# EAGLE design Filter_V0.2 (EAGLE 9.5.2)

## Sheet 1 of 3
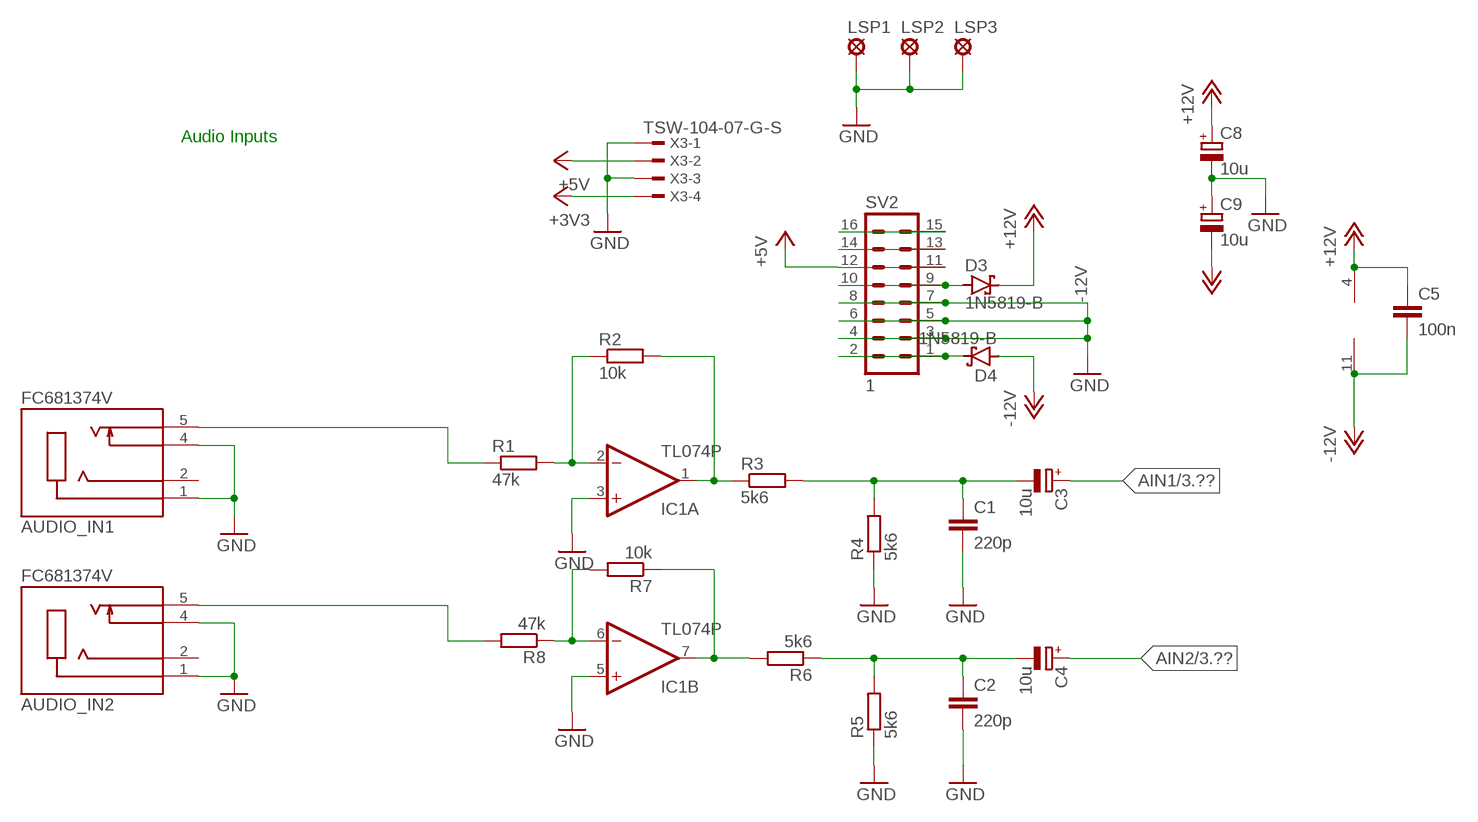
[diagram p0: schematic, sheet 1]

### Parts
AUDIO_IN1  FC681374V  [CLIFF_FC681374V]
AUDIO_IN2  FC681374V  [CLIFF_FC681374V]
C1  220p  C-EU025-024X044  [C025-024X044]
C2  220p  C-EU025-024X044  [C025-024X044]
C3  10u  CPOL-EUE2.5-7  [E2,5-7]
C4  10u  CPOL-EUE2.5-7  [E2,5-7]
C5  100n  C-EU025-024X044  [C025-024X044]
C8  10u  CPOL-EUE2.5-7  [E2,5-7]
C9  10u  CPOL-EUE2.5-7  [E2,5-7]
D3  1N5819-B  [DO41-7.6]
D4  1N5819-B  [DO41-7.6]
IC1  TL074P  [DIL14]
LSP1  LSP10  [LSP10]
LSP2  LSP10  [LSP10]
LSP3  LSP10  [LSP10]
R1  47k  R-EU_0204/7  [0204/7]
R2  10k  R-EU_0204/7  [0204/7]
R3  5k6  R-EU_0204/7  [0204/7]
R4  5k6  R-EU_0204/7  [0204/7]
R5  5k6  R-EU_0204/7  [0204/7]
R6  5k6  R-EU_0204/7  [0204/7]
R7  10k  R-EU_0204/7  [0204/7]
R8  47k  R-EU_0204/7  [0204/7]
SV2  1  ML16  [ML16]
X3  TSW-104-07-G-S  [TSW-104-XX-G-S]

### Nets
+3V3 [Supply]: X3.4 ; also sheet 3
+5V [Supply]: SV2.11 SV2.12 X3.2 ; also sheet 3
+12V [Supply]: C5.1 C8.+ D3.C IC1.4(P:V+)
-12V [Supply]: C5.2 C9.- D4.A IC1.11(P:V-)
AIN1 [Audio]: C3.+ ; also sheet 3
AIN2 [Audio]: C4.+ ; also sheet 3
GND [Supply]: AUDIO_IN1.1 AUDIO_IN1.4 AUDIO_IN2.1 AUDIO_IN2.4 C1.2 C2.2 C8.- C9.+ IC1.3(A:+IN) IC1.5(B:+IN) LSP1.MP LSP2.MP LSP3.MP R4.1 R5.1 SV2.3 SV2.4 SV2.5 SV2.6 SV2.7 SV2.8 X3.1 X3.3 ; also sheet 2,3
N$1: IC1.6(B:-IN) R7.2 R8.1
N$3: IC1.1(A:OUT) R2.2 R3.1
N$4: C1.1 C3.- R3.2 R4.2
N$5: IC1.7(B:OUT) R6.2 R7.1
N$6: C2.1 C4.- R5.2 R6.1
N$8: IC1.2(A:-IN) R1.2 R2.1
N$9: AUDIO_IN1.5 R1.1
N$10: AUDIO_IN2.5 R8.2
N$20 [Supply]: D3.A SV2.9 SV2.10
N$21 [Supply]: D4.C SV2.1 SV2.2
N$25: SV2.13 SV2.14
N$26: SV2.15 SV2.16
Unconnected: AUDIO_IN1.2 AUDIO_IN2.2

### Notes on the sheet
- Audio Inputs

## Sheet 2 of 3
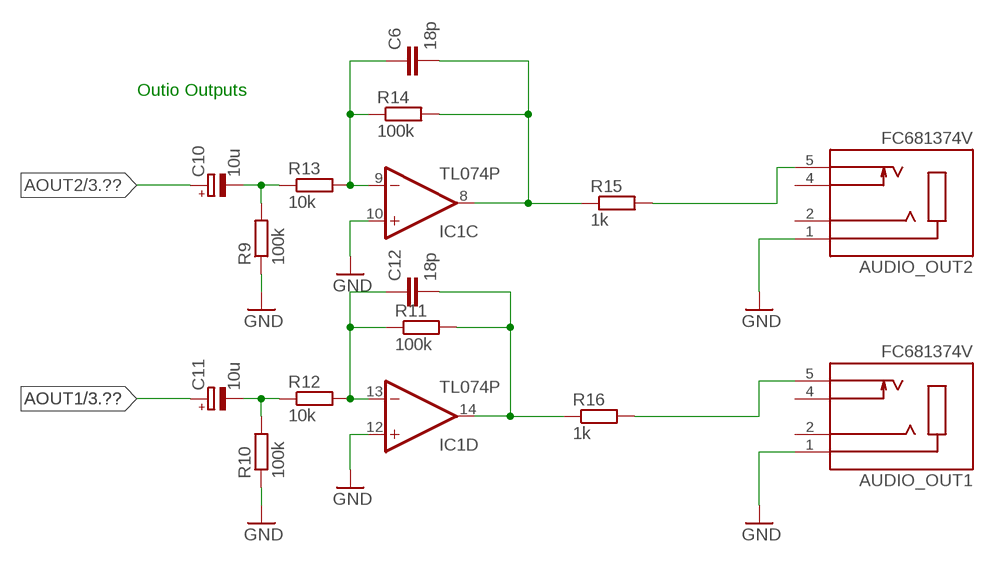
[diagram p1: schematic, sheet 2]

### Parts
AUDIO_OUT1  FC681374V  [CLIFF_FC681374V]
AUDIO_OUT2  FC681374V  [CLIFF_FC681374V]
C6  18p  C-EU025-024X044  [C025-024X044]
C10  10u  CPOL-EUE2.5-7  [E2,5-7]
C11  10u  CPOL-EUE2.5-7  [E2,5-7]
C12  18p  C-EU025-024X044  [C025-024X044]
R9  100k  R-EU_0204/7  [0204/7]
R10  100k  R-EU_0204/7  [0204/7]
R11  100k  R-EU_0204/7  [0204/7]
R12  10k  R-EU_0204/7  [0204/7]
R13  10k  R-EU_0204/7  [0204/7]
R14  100k  R-EU_0204/7  [0204/7]
R15  1k  R-EU_0204/7  [0204/7]
R16  1k  R-EU_0204/7  [0204/7]

### Nets
AOUT1 [Audio]: C11.+ ; also sheet 3
AOUT2 [Audio]: C10.+ ; also sheet 3
GND [Supply]: AUDIO_OUT1.1 AUDIO_OUT2.1 IC1.10(C:+IN) IC1.12(D:+IN) R9.1 R10.1 ; also sheet 1,3
N$11: C6.1 IC1.9(C:-IN) R13.2 R14.1
N$12: C6.2 IC1.8(C:OUT) R14.2 R15.1
N$13: C12.1 IC1.13(D:-IN) R11.1 R12.2
N$14: C12.2 IC1.14(D:OUT) R11.2 R16.1
N$15: AUDIO_OUT1.5 R16.2
N$16: AUDIO_OUT2.5 R15.2
N$17: C10.- R9.2 R13.1
N$18: C11.- R10.2 R12.1
Unconnected: AUDIO_OUT1.2 AUDIO_OUT1.4 AUDIO_OUT2.2 AUDIO_OUT2.4

### Notes on the sheet
- Outio Outputs

## Sheet 3 of 3
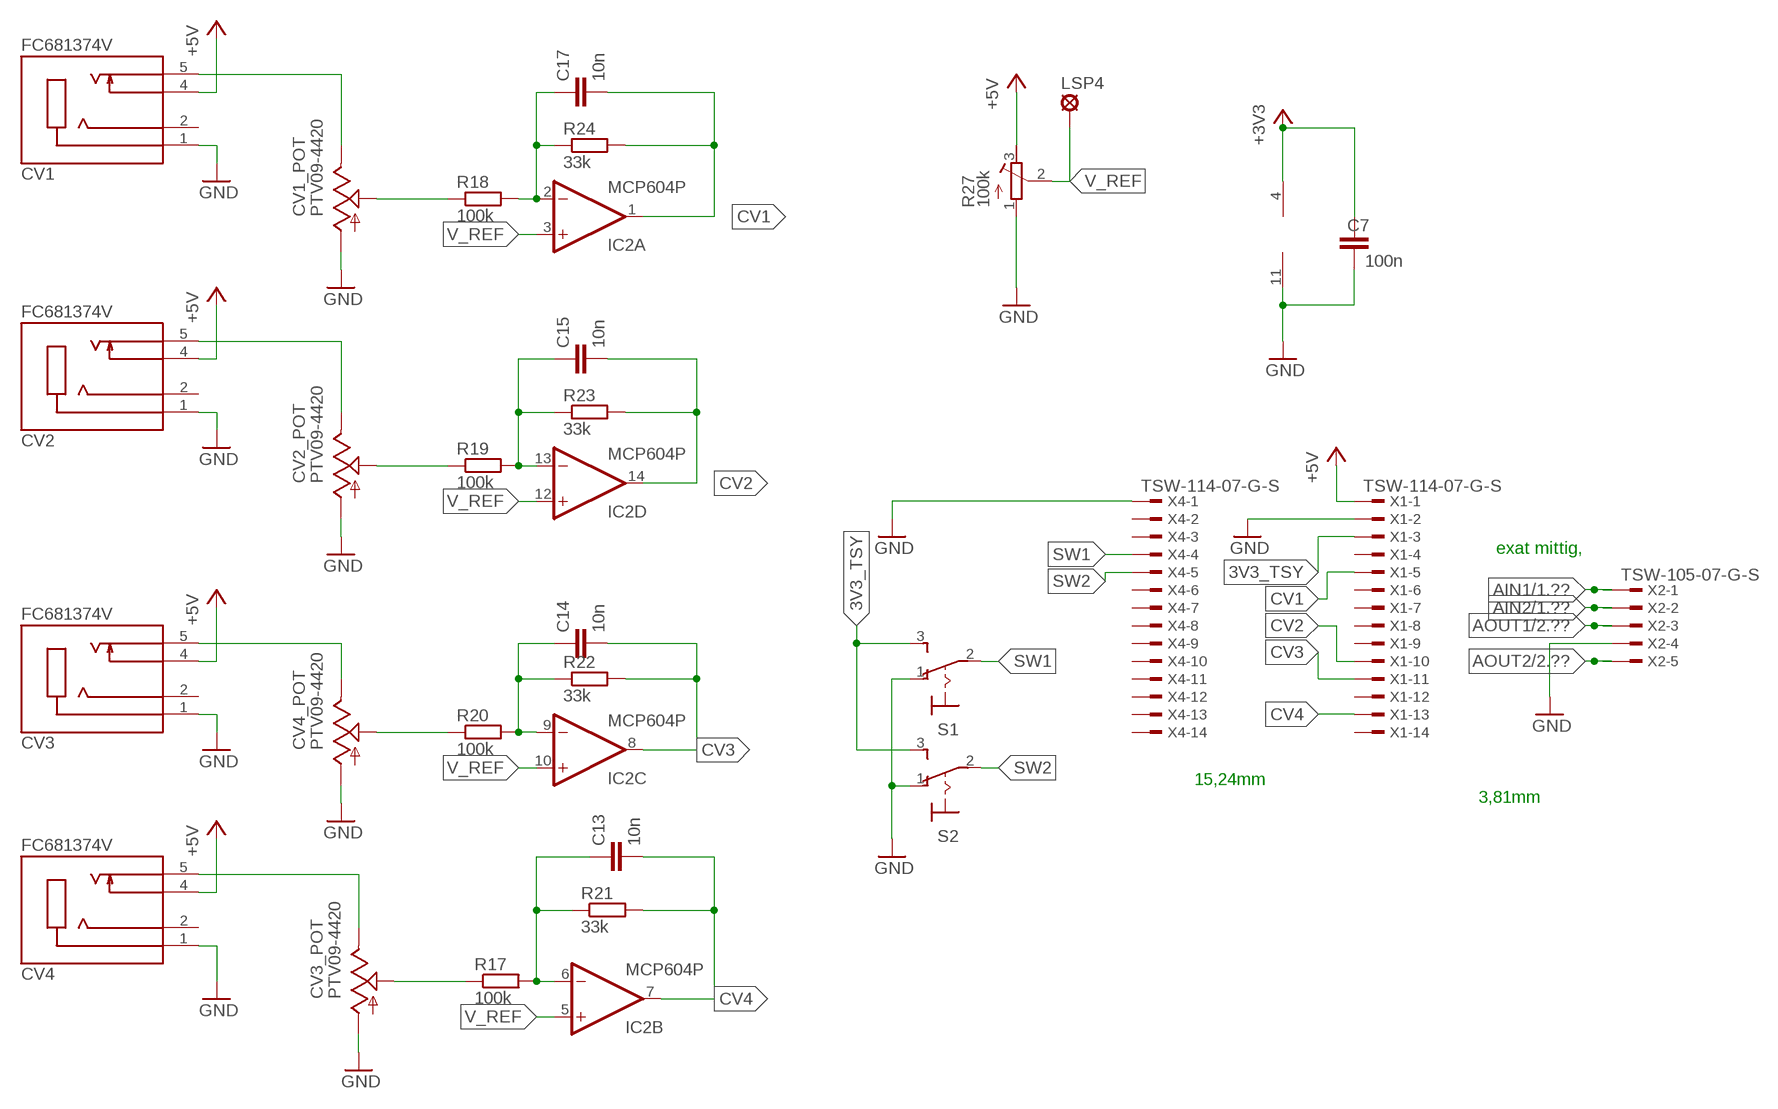
[diagram p2: schematic, sheet 3]

### Parts
C7  100n  C-EU025-024X044  [C025-024X044]
C13  10n  C-EU025-024X044  [C025-024X044]
C14  10n  C-EU025-024X044  [C025-024X044]
C15  10n  C-EU025-024X044  [C025-024X044]
C17  10n  C-EU025-024X044  [C025-024X044]
CV1  FC681374V  [CLIFF_FC681374V]
CV1_POT  PTV09-4420  [PTV09]
CV2  FC681374V  [CLIFF_FC681374V]
CV2_POT  PTV09-4420  [PTV09]
CV3  FC681374V  [CLIFF_FC681374V]
CV3_POT  PTV09-4420  [PTV09]
CV4  FC681374V  [CLIFF_FC681374V]
CV4_POT  PTV09-4420  [PTV09]
IC2  MCP604P  [DIL14]
LSP4  LSP10  [LSP10]
R17  100k  R-EU_0204/7  [0204/7]
R18  100k  R-EU_0204/7  [0204/7]
R19  100k  R-EU_0204/7  [0204/7]
R20  100k  R-EU_0204/7  [0204/7]
R21  33k  R-EU_0204/7  [0204/7]
R22  33k  R-EU_0204/7  [0204/7]
R23  33k  R-EU_0204/7  [0204/7]
R24  33k  R-EU_0204/7  [0204/7]
R27  100k  R-TRIMM64W  [RTRIM64W]
S1  M9040P  [M9040P]
S2  M9040P  [M9040P]
X1  TSW-114-07-G-S  [TSW-114-XX-G-S]
X2  TSW-105-07-G-S  [TSW-105-XX-G-S]
X4  TSW-114-07-G-S  [TSW-114-XX-G-S]

### Nets
3V3_TSY [Supply]: S1.3(S) S2.3(S) X1.3
+3V3 [Supply]: C7.1 IC2.4(P:V+) ; also sheet 1
+5V [Supply]: CV1.4 CV2.4 CV3.4 CV4.4 R27.3(E) X1.1 ; also sheet 1
AIN1 [Audio]: X2.1 ; also sheet 1
AIN2 [Audio]: X2.2 ; also sheet 1
AOUT1 [Audio]: X2.3 ; also sheet 2
AOUT2 [Audio]: X2.5 ; also sheet 2
CV1 [Controll]: C17.2 IC2.1(A:OUT) R24.2 X1.5
CV2 [Controll]: C15.2 IC2.14(D:OUT) R23.2 X1.10
CV3 [Controll]: C14.2 IC2.8(C:OUT) R22.2 X1.11
CV4 [Controll]: C13.2 IC2.7(B:OUT) R21.2 X1.13
GND [Supply]: C7.2 CV1.1 CV1_POT.1(A) CV2.1 CV2_POT.1(A) CV3.1 CV3_POT.1(A) CV4.1 CV4_POT.1(A) IC2.11(P:V-) R27.1(A) S1.1(O) S2.1(O) X1.2 X2.4 X4.1 ; also sheet 1,2
N$19: C13.1 IC2.6(B:-IN) R17.2 R21.1
N$23: C14.1 IC2.9(C:-IN) R20.2 R22.1
N$27: C15.1 IC2.13(D:-IN) R19.2 R23.1
N$29: C17.1 IC2.2(A:-IN) R18.2 R24.1
N$31: CV4_POT.2(S) R20.1
N$32: CV2_POT.2(S) R19.1
N$33: CV1_POT.2(S) R18.1
N$34: CV3_POT.2(S) R17.1
N$35: CV1.5 CV1_POT.3(E)
N$36: CV2.5 CV2_POT.3(E)
N$37: CV3.5 CV4_POT.3(E)
N$38: CV3_POT.3(E) CV4.5
SW1 [Controll]: S1.2(P) X4.4
SW2 [Controll]: S2.2(P) X4.5
V_REF [Supply]: IC2.3(A:+IN) IC2.5(B:+IN) IC2.10(C:+IN) IC2.12(D:+IN) LSP4.MP R27.2(S)
Unconnected: CV1.2 CV2.2 CV3.2 CV4.2 X1.4 X1.6 X1.7 X1.8 X1.9 X1.12 X1.14 X4.2 X4.3 X4.6 X4.7 X4.8 X4.9 X4.10 X4.11 X4.12 X4.13 X4.14

### Notes on the sheet
- exat mittig,
- 15,24mm
- 3,81mm

## Library data of the parts
AUDIO_IN1 AUDIO_IN2 AUDIO_OUT1 AUDIO_OUT2 CV1-CV4 = FC681374V:FC681374V: Flush-mounted stereo jack socket 3.5 mm [Cliff] FC681374V Flush-mounted stereo jack socket 3.5 mm; AVAILABILITY: Unavailable; DESCRIPTION: Flush-mounted stereo jack socket 3.5 mm [Cliff] FC681374V Flush-mounted stereo jack socket 3.5 mm; MF: Cliff; MP: FC681374V; PACKAGE: None; PRICE: None
C1 C2 C5-C7 C12-C15 C17 = rcl:C-EU: CAPACITOR, European symbol; SPICEPREFIX: C
C3 C4 C8-C11 = rcl:CPOL-EU: POLARIZED CAPACITOR, European symbol; SPICEPREFIX: C
CV1_POT CV2_POT CV3_POT CV4_POT = PTV09:PTV09; AVAILABILITY: Unavailable; DESCRIPTION: Instant Conn Red 22-18awg 100/Box; MF: Nichifu; MP: PTV-09; PACKAGE: None; PRICE: None
D3 D4 = diode:1N581*: 1.0A SCHOTTKY BARRIER RECTIFIER Source: http://www.diodes.com/datasheets/ds23001.pdf
IC1 = linear:TL074: OP AMP
IC2 = linear:MCP604: Quad Op Amp 2.7V to 6.0V Single Supply CMOS Source: http://ww1.microchip.com/downloads/en/DeviceDoc/21314g.pdf; SPICEPREFIX: J
LSP1-LSP4 = solpad:LSP10: SOLDER PAD drill 1.0 mm, distributor Buerklin, 12H555
R1-R24 = rcl:R-EU_: RESISTOR, European symbol; SPICEPREFIX: R
R27 = rcl:R-TRIMM: Trimm resistor; SPICEMODEL: X; SPICEPREFIXL: POT
S1 S2 = switch:M9040P: TOGGLE SWITCH Marquardt
SV2 = con-harting-ml:ML16: HARTING; OC_FARNELL: unknown; OC_NEWARK: unknown
X1 X4 = con-samtec:TSW-114-*-G-S: THROUGH-HOLE .025" SQ POST HEADER Source: Samtec TSW.pdf; MF: Samtec Inc.; MPN: TSW-114-07-G-S
X2 = con-samtec:TSW-105-*-G-S: THROUGH-HOLE .025" SQ POST HEADER Source: Samtec TSW.pdf; MF: Samtec Inc.; MPN: TSW-105-07-G-S
X3 = con-samtec:TSW-104-*-G-S: THROUGH-HOLE .025" SQ POST HEADER Source: Samtec TSW.pdf; MF: Samtec Inc.; MPN: TSW-104-07-G-S

## Net classes
0 default: width 0.65 mm, drill 0.65 mm
1 Audio: width 0.65 mm, drill 0.65 mm
2 Supply: width 1 mm, drill 0.65 mm
3 digtal: width 0.65 mm, drill 0.65 mm
4 Controll: width 0.65 mm, drill 0.65 mm

## Board
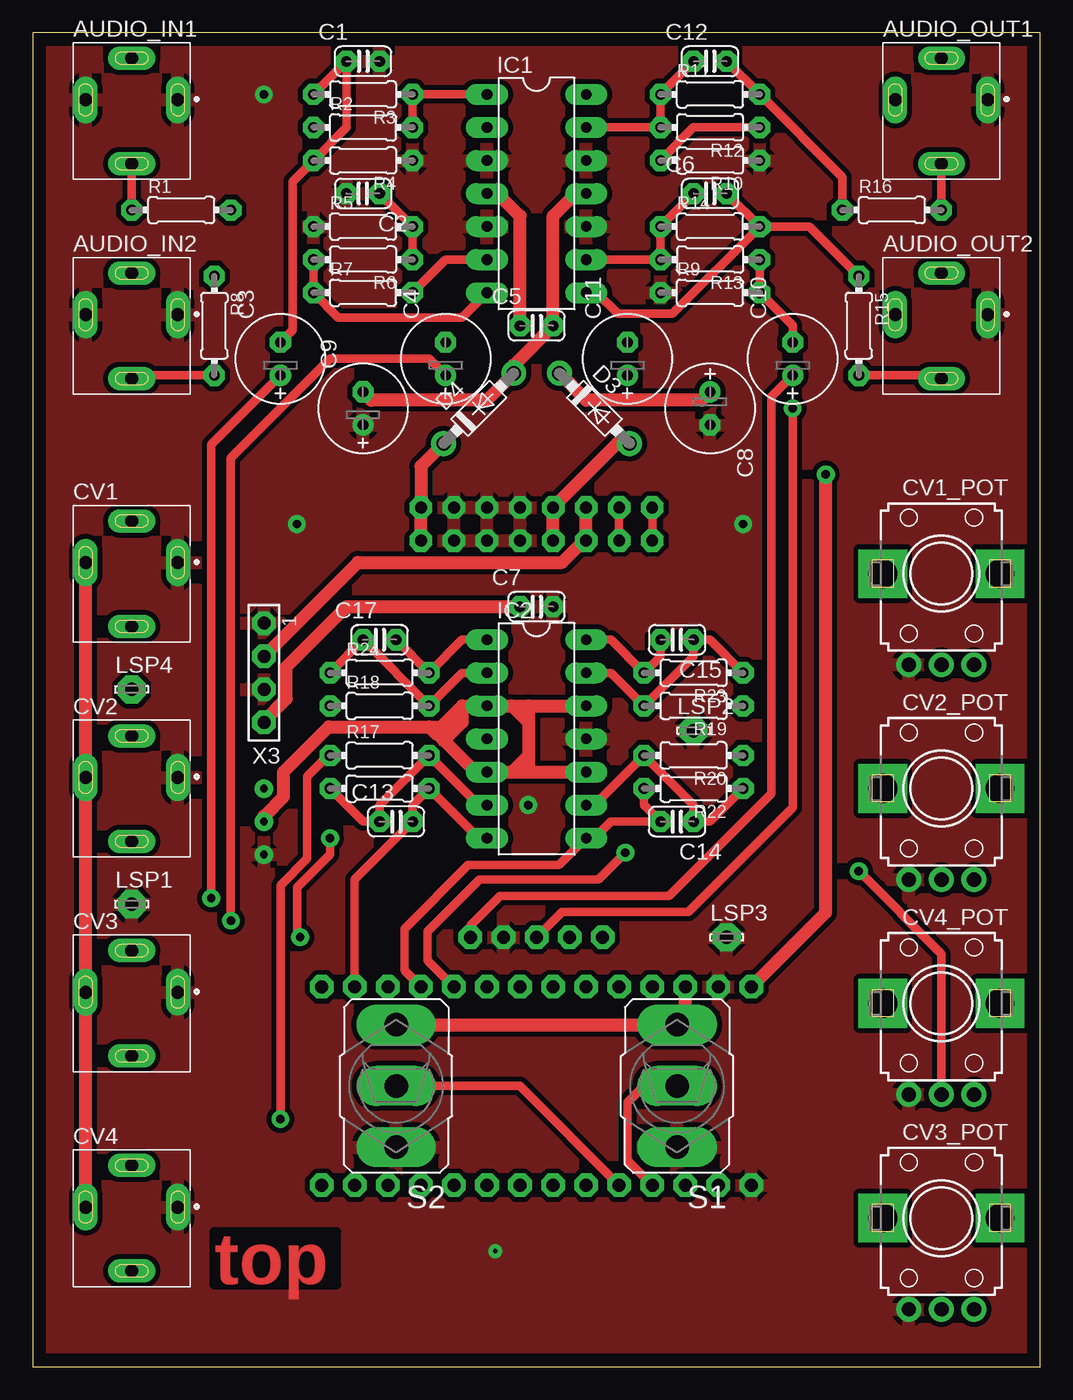
[diagram p3: board, top side]
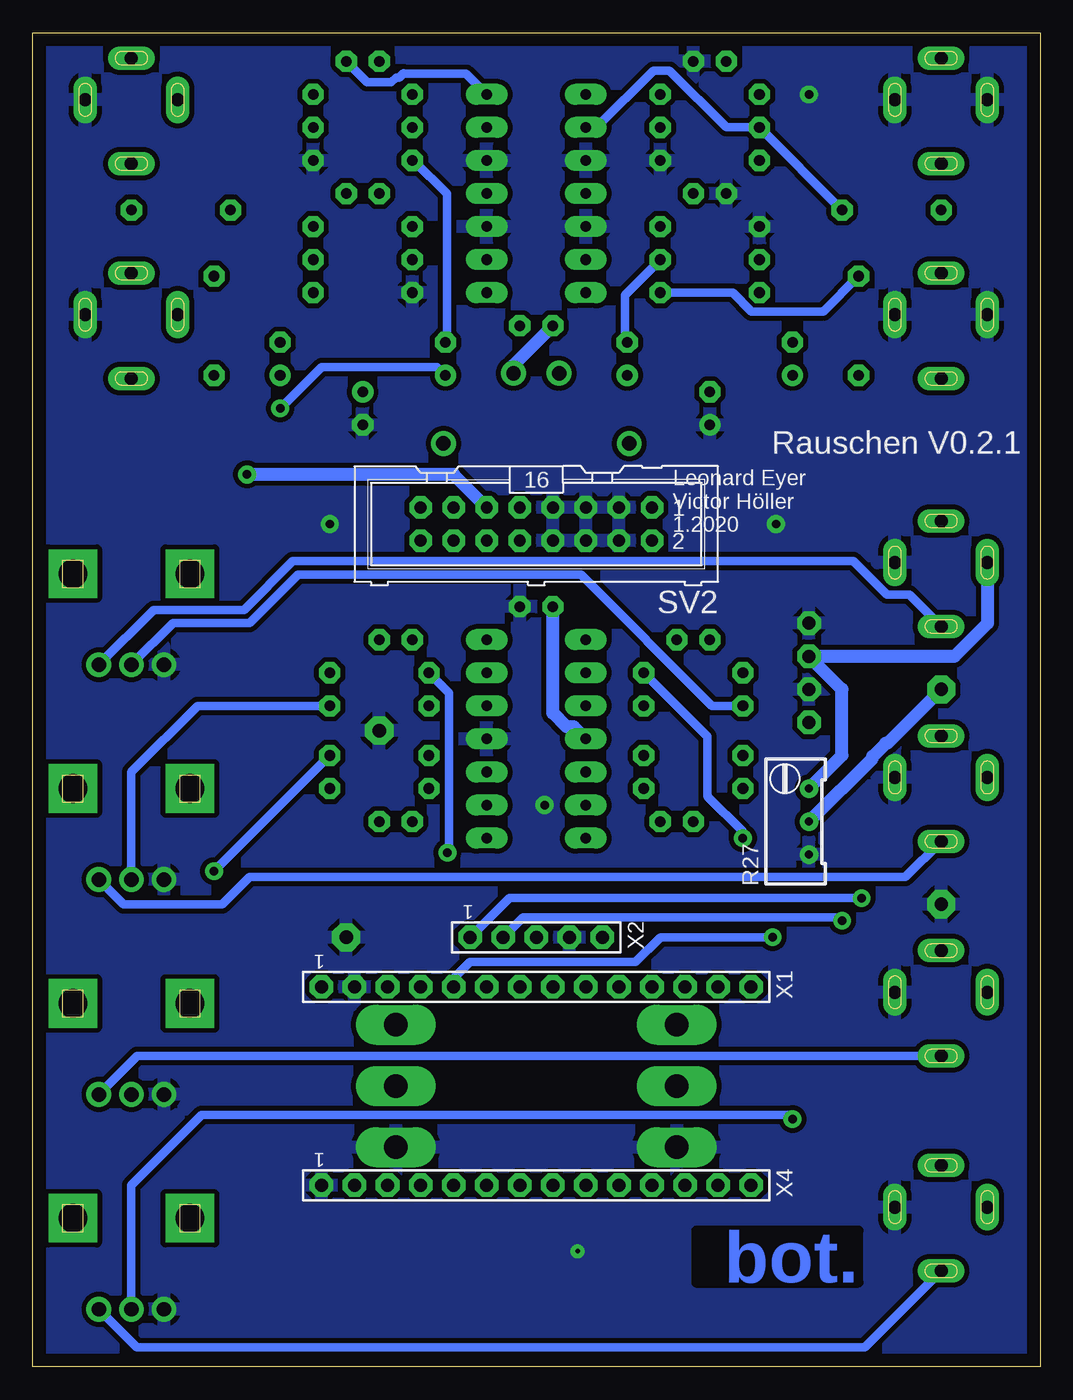
[diagram p4: board, bottom side, seen from below]

Size 77.45 x 102.54 mm. Coordinates in mm from the lower left corner, seen from the top.
Outline: 0,0 77.45,0 77.45,102.54 0,102.54 0,0
Copper layers (1*16): Top 0.035mm / dielectric 1.5mm / Bottom 0.035mm
Design rules "Projektlabor_THT_DRC_2019 *": minimum track width 0.6mm, minimum drill 0.6mm, track to track 15mil, track to pad 12mil, pad to pad 16mil, via to via 20mil, smd to smd 8mil, copper to edge 40mil, drill to drill 16mil, minimum pad ring 16mil, minimum via ring 14mil, stop-mask expansion 4mil, vias tented up to drill 0mil, thermal gap 15mil

### Footprints (pad centres in the part's own frame; a part is rotated, then mirrored left to right if it is on the bottom)
CLIFF_FC681374V = drill 1 long: 1 3.55,0.85; 2 0,4.05; 4 -3.55,0.85; 5 0,-4.05
C025-024X044 = drill 0.813 octagon: 1 -1.27,0; 2 1.27,0
E2,5-7 = drill 0.813 pad 1.6: + -1.27,0 | drill 0.813 pad 1.6 octagon: - 1.27,0
PTV09 = drill 1.1 pad 1.676: 1 -2.5,-7; 2 0,-7; 3 2.5,-7 | drill 2.2 square: M1 4.5,0; M2 -4.5,0
DO41-7.6 = drill 1.1 pad 1.7: A 3.81,0; C -3.81,0
DIL14 = drill 0.813 long: 1 -7.62,-3.81; 2 -5.08,-3.81; 3 -2.54,-3.81; 4 0,-3.81; 5 2.54,-3.81; 6 5.08,-3.81; 7 7.62,-3.81; 8 7.62,3.81; 9 5.08,3.81; 10 2.54,3.81; 11 0,3.81; 12 -2.54,3.81; 13 -5.08,3.81; 14 -7.62,3.81
LSP10 = drill 1.016 pad 2.159 octagon: MP 0,0
0204/7 = drill 0.813 octagon: 1 -3.81,0; 2 3.81,0
RTRIM64W = drill 0.61: 1 1.27,-2.54; 2 1.27,0; 3 1.27,2.54
M9040P = drill 1.803 long: 1 0,4.699; 2 0,0; 3 0,-4.699
ML16 = drill 0.914 octagon: 1 -8.89,-1.27; 2 -8.89,1.27; 3 -6.35,-1.27; 4 -6.35,1.27; 5 -3.81,-1.27; 6 -3.81,1.27; 7 -1.27,-1.27; 8 -1.27,1.27; 9 1.27,-1.27; 10 1.27,1.27; 11 3.81,-1.27; 12 3.81,1.27; 13 6.35,-1.27; 14 6.35,1.27; 15 8.89,-1.27; 16 8.89,1.27
TSW-114-XX-G-S = drill 1 pad 1.5 octagon: 1 16.51,0; 2 13.97,0; 3 11.43,0; 4 8.89,0; 5 6.35,0; 6 3.81,0; 7 1.27,0; 8 -1.27,0; 9 -3.81,0; 10 -6.35,0; 11 -8.89,0; 12 -11.43,0; 13 -13.97,0; 14 -16.51,0
TSW-105-XX-G-S = drill 1 pad 1.5 octagon: 1 5.08,0; 2 2.54,0; 3 0,0; 4 -2.54,0; 5 -5.08,0
TSW-104-XX-G-S = drill 1 pad 1.5 octagon: 1 3.81,0; 2 1.27,0; 3 -1.27,0; 4 -3.81,0

### Placement (x,y rotation side)
AUDIO_IN1  7.62,96.52 0 top
AUDIO_IN2  7.62,80.01 0 top
AUDIO_OUT1  69.85,96.52 0 top
AUDIO_OUT2  69.85,80.01 0 top
C1  25.4,100.33 0 top
C2  25.4,90.17 180 top
C3  19.05,77.47 90 top
C4  31.75,77.47 90 top
C5  38.73,80.01 0 top
C6  52.07,90.17 0 top
C7  38.73,58.42 0 top
C8  52.07,73.66 270 top
C9  25.4,73.66 90 top
C10  58.42,77.47 90 top
C11  45.72,77.47 90 top
C12  52.07,100.33 0 top
C13  27.94,41.91 0 top
C14  49.53,41.91 180 top
C15  49.53,55.88 180 top
C17  26.67,55.88 0 top
CV1  7.62,60.96 0 top
CV1_POT  69.85,60.96 0 top
CV2  7.62,44.45 0 top
CV2_POT  69.85,44.45 0 top
CV3  7.62,27.94 0 top
CV3_POT  69.85,11.43 0 top
CV4  7.62,11.43 0 top
CV4_POT  69.85,27.94 0 top
D3  43.18,73.66 315 top
D4  34.29,73.66 45 top
IC1  38.73,90.17 270 top
IC2  38.73,48.26 270 top
LSP1  7.62,35.56 0 top
LSP2  50.8,48.9 0 top
LSP3  53.34,33.02 0 top
LSP4  7.62,52.07 0 top
R1  11.43,88.9 0 top
R2  25.4,95.25 0 top
R3  25.4,97.79 180 top
R4  25.4,92.71 180 top
R5  25.4,87.63 0 top
R6  25.4,85.09 180 top
R7  25.4,82.55 0 top
R8  13.97,80.01 270 top
R9  52.07,82.55 0 top
R10  52.07,92.71 180 top
R11  52.07,97.79 0 top
R12  52.07,95.25 180 top
R13  52.07,85.09 180 top
R14  52.07,87.63 0 top
R15  63.5,80.01 270 top
R16  66.04,88.9 0 top
R17  26.67,46.99 0 top
R18  26.67,50.8 0 top
R19  50.8,50.8 180 top
R20  50.8,46.99 180 top
R21  26.67,44.45 0 top
R22  50.8,44.45 180 top
R23  50.8,53.34 180 top
R24  26.67,53.34 0 top
R27  19.05,41.91 0 bottom
S1  49.53,21.59 180 top
S2  27.94,21.59 180 top
SV2  38.73,64.77 180 bottom
X1  38.73,29.21 180 bottom
X2  38.73,33.02 180 bottom
X3  17.78,53.34 90 top
X4  38.73,13.97 180 bottom

### Tracks (layer width: path | path; a pad name or v marks a point on that pad's centre or on a via)
3V3_TSY
  Top 1: S2.3 S1.3 50.16,26.92 X1.3
+3V3
  Top 1: X3.4 17.78,49.65 19.49,51.36 19.49,53.78 24.13,58.42 C7.1
  Bottom 1: IC2.4 35.85,49.18 36.41,49.18 37.47,50.24 C7.1
+5V  (via drill 0.65)
  Top 1: CV1.4 CV2.4 CV3.4 CV4.4 | SV2.11 SV2.12 42.36,63.5 40.7,61.83 25,61.83 X3.2 | X1.1 60.96,34.92 v60.96,68.58
  Bottom 1: SV2.11 45.09,68.58 v60.96,68.58 | CV1.4 4.07,57.13 6.59,54.61 X3.2 15.24,52.07 15.24,46.99 R27.3
+12V
  Top 1: IC1.4 35.74,90.17 37.47,88.44 C5.1 | C8.+ 51.44,74.3 42.55,74.3 D3.C
  Bottom 1: D3.C 40.49,76.99 C5.1
-12V
  Top 1: IC1.11 41.73,90.17 40.01,88.44 C5.2 36.98,76.99 D4.A 34.92,74.3 26.04,74.3 C9.-
AIN1  (via drill 0.65)
  Top 0.65: C3.+ 13.73,70.88 v13.73,36.03
  Bottom 0.65: v13.73,36.03 40.8,36.03 X2.1
AIN2  (via drill 0.65)
  Top 0.65: v15.24,34.29 15.24,69.85 22.86,77.47 30.48,77.47 C4.+
  Bottom 0.65: v15.24,34.29 15.51,34.56 39.74,34.56 X2.2
AOUT1  (via drill 0.65)
  Top 0.65: v58.42,73.66 58.42,69.86 58.42,69.85 58.42,43 50.4,34.98 40.69,34.98 X2.3
  Bottom 0.65: C11.+ 46.35,76.83 55.24,76.83 v58.42,73.66
AOUT2
  Top 0.65: C10.+ 56.77,74.55 56.77,44.07 48.9,36.2 35.93,36.2 33.66,33.92 X2.5
CV1  (via drill 0.65)
  Top 0.65: C17.2 R24.2 33.02,55.88 IC2.1 | v22.86,40.64 22.86,39.37 20.32,36.83 20.32,33.02 v20.56,33.02
  Bottom 0.65: R24.2 25.57,48.43 25.57,43.85 22.86,41.14 v22.86,40.64 | X1.5 45.09,29.84 43.81,31.11 31.11,31.11 29.21,33.02 v20.56,33.02
CV2  (via drill 0.65)
  Top 0.65: C15.2 48.26,54.61 R23.2 44.45,55.88 IC2.14 | v45.56,39.52 43.51,37.47 34.34,37.47 30.35,33.47 30.35,31.25 X1.10
  Bottom 0.65: v45.56,39.52 45.44,39.66 45.44,51.78 R23.2
CV3
  Top 0.65: R22.2 46.99,43.18 C14.2 44.45,41.91 43.18,40.64 IC2.8 40.46,38.56 33.48,38.56 28.57,33.66 28.57,30.48 X1.11
CV4
  Top 0.65: IC2.7 34.29,40.64 R21.2 29.21,43.18 C13.2 24.77,37.47 X1.13
GND  (via drill 0.35, 0.65)
  other vias: 35.56,8.89 54.61,64.77 20.32,64.77 17.78,97.79 38.1,43.18
  pour Top: -1.27,104.14 78.74,104.14 78.74,-1.27 -1.27,-1.27
  pour Bottom: 0,104.14 78.74,104.14 78.74,-1.27 0,-1.27
N$1
  Top 0.65: IC1.6 31.75,85.09 R7.2
  Bottom 0.65: R7.2 23.63,82.55 22.19,81.11 16.68,81.11 R8.1
N$3
  Top 0.65: IC1.1 R3.1 R2.2
N$4
  Top 0.65: R3.2 C1.1 24.13,95.25 R4.2 19.97,91.09 19.97,79.66 C3.-
N$5
  Top 0.65: R6.2 R7.1 23.5,80.64 33.02,80.64 IC1.7
N$6
  Top 0.65: R6.1 R5.2 C2.1
  Bottom 0.65: C4.- 31.92,78.91 31.92,82.38 R6.1
N$8
  Bottom 0.65: IC1.2 34.11,95.25 29.75,99.61 28.49,99.61 24.13,95.25 R2.1 R1.2
N$9
  Top 0.65: R1.1 AUDIO_IN1.5
N$10
  Top 0.65: AUDIO_IN2.5 7.86,76.2 R8.2
N$11
  Top 0.65: C6.1 R14.1 R13.2 IC1.9
N$12
  Top 0.65: IC1.8 43.36,82.55 44.98,80.93 49.18,80.93 R14.2 | C6.2 R14.2 | R14.2 59.69,87.63 R15.1
N$13
  Top 0.65: C12.1 R11.1 R12.2 IC1.13
N$14
  Top 0.65: C12.2 R11.2 62.23,91.44 R16.1
  Bottom 0.65: C12.2 51.72,98.71 49.88,98.71 49.53,99.06 49.28,99.06 48.93,99.41 48.9,99.38 44.13,99.38 IC1.14
N$15
  Top 0.65: AUDIO_OUT1.5 R16.2
N$16
  Top 0.65: R15.2 69.61,76.2 AUDIO_OUT2.5
N$17
  Top 0.65: C10.- 58.42,80.01 R9.2 R13.1
N$18
  Top 0.65: R10.2 50.8,95.25 R12.1
  Bottom 0.65: C11.- 45.61,78.85 45.61,90.17 48.15,92.71 R10.2
N$19
  Top 0.65: IC2.6 34.29,43.18 R17.2 26.67,43.18 C13.1 25.4,41.91 R21.1
N$20
  Top 1: SV2.10 SV2.9 44.93,70.97 D3.A
N$21
  Top 1: SV2.2 SV2.1 29.84,69.22 D4.C
N$23
  Top 0.65: IC2.9 43.18,43.18 R20.2 50.8,43.18 C14.1 52.07,41.91 R22.1
N$25
  Top 0.65: SV2.14 SV2.13
N$26
  Top 0.65: SV2.16 SV2.15
N$27
  Top 0.65: R23.1 52.07,55.88 C15.1 50.8,54.61 R19.2 44.45,53.34 IC2.13
N$29
  Top 0.65: R24.1 C17.1 R18.2 33.02,53.34 IC2.2
N$31  (via drill 0.65)
  Top 0.65: v63.5,38.1 69.85,31.75 CV4_POT.2
  Bottom 0.65: v63.5,38.1 R20.1
N$32
  Bottom 0.65: R19.1 64.77,50.8 69.85,45.72 CV2_POT.2
N$33
  Bottom 0.65: R18.1 25.23,50.8 35.31,60.88 57.04,60.88 60.77,57.15 66.66,57.15 CV1_POT.2
N$34  (via drill 0.65)
  Top 0.65: R17.1 22.73,46.99 21.1,45.37 21.1,39.07 19.05,37.02 v19.05,19.05
  Bottom 0.65: v19.05,19.05 19.37,19.37 64.45,19.37 69.85,13.97 CV3_POT.2
N$35
  Bottom 0.65: CV1_POT.3 68.13,58.18 61.2,58.18 57.47,61.91 14.35,61.91 11.81,59.37 10.08,59.37 CV1.5
N$36
  Bottom 0.65: CV2.5 10.36,37.66 60.77,37.66 62.87,35.56 70.46,35.56 CV2_POT.3
N$37
  Bottom 0.65: CV3.5 52.07,23.89 52.31,23.89 69.4,23.89 CV4_POT.3
N$38
  Bottom 0.65: CV4.5 13.48,1.52 69.44,1.52 CV3_POT.3
SW1
  Top 0.65: X4.4 45.72,15.88 45.72,20.32 46.99,21.59 S1.2
SW2
  Top 0.65: S2.2 37.47,21.59 X4.5
V_REF
  Top 1: IC2.5 38.1,45.72 | 30.48,49.18 31.4,49.18 33.02,50.8 | 33.02,50.8 IC2.3 | 30.48,49.18 31.05,48.61 31.15,48.61 31.62,48.13 | IC2.5 34.04,45.72 31.62,48.13 | IC2.3 38.1,50.8 38.1,49.53 | 38.1,49.53 38.1,46.99 | 38.1,46.99 38.1,45.72 | IC2.3 36.83,50.8 38.1,49.53 | IC2.5 36.83,45.72 38.1,46.99 | 33.02,50.8 33.02,49.53 31.62,48.13 | IC2.3 IC2.12 | 38.1,45.72 IC2.10 | R27.2 17.78,42.31 19.3,43.82 19.3,45.71 22.77,49.18 30.48,49.18
  Bottom 1: LSP4.MP 11.77,47.92 11.88,47.92 12.88,46.91 12.88,46.81 R27.2

### Text on the board
Top: top
Bottom: bot.
bNames: Rauschen V0.2.1 | Leonard Eyer / Victor Höller / 1.2020